# Altium schematic sheet 07-CAN&UART.SchDoc
size B
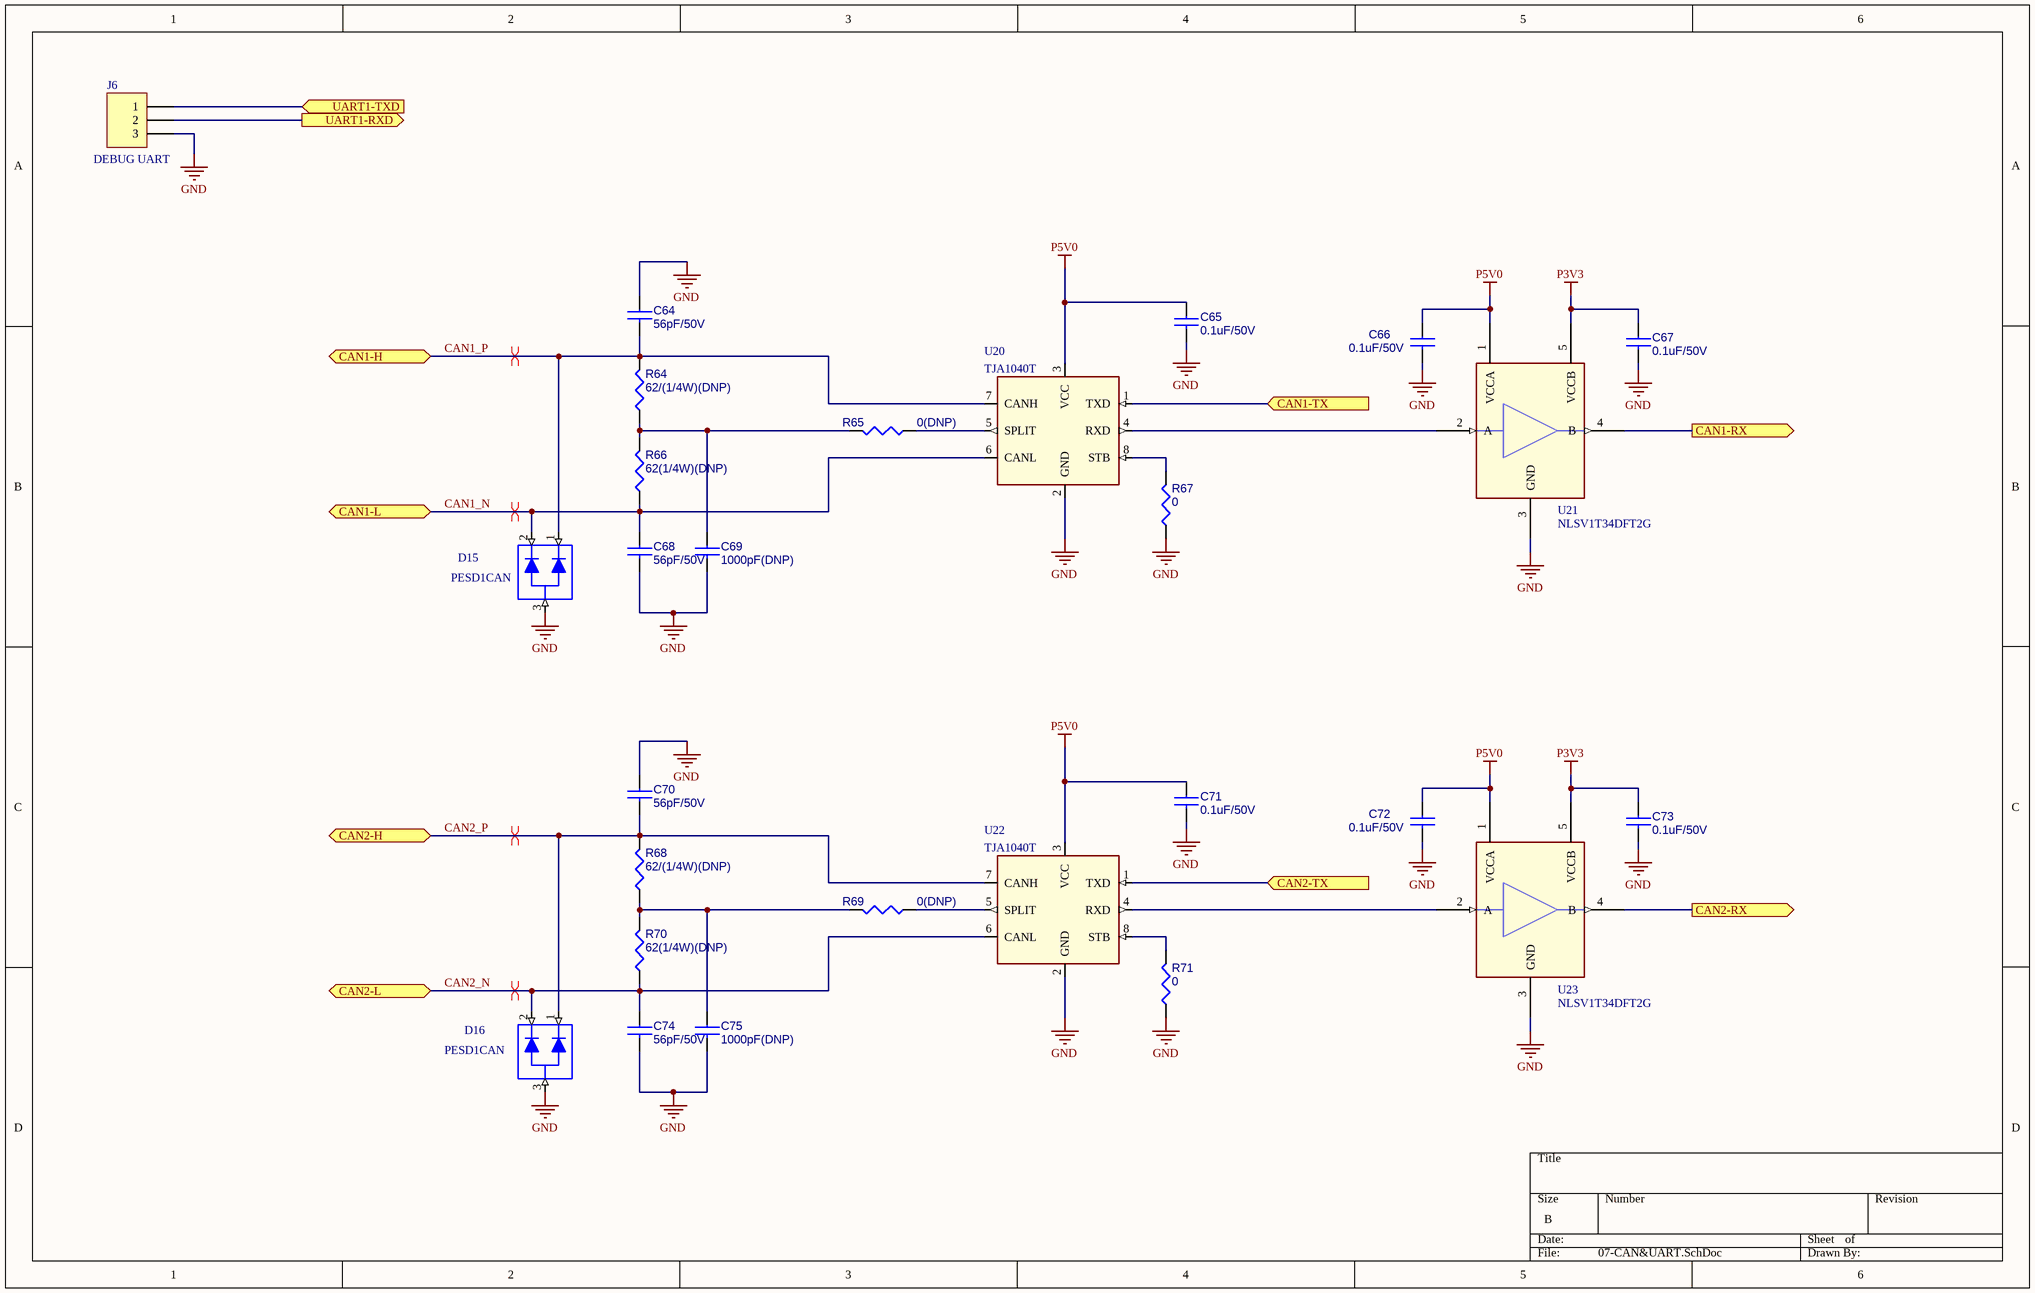
[diagram p0: 07-CAN&UART.SchDoc]

## Parts
C64  56pF/50V  [0402]
C65  0.1uF/50V  [0402]
C66  0.1uF/50V  [0402]
C67  0.1uF/50V  [0402]
C68  56pF/50V  [0402]
C69  1000pF(DNP)  [0402]
C70  56pF/50V  [0402]
C71  0.1uF/50V  [0402]
C72  0.1uF/50V  [0402]
C73  0.1uF/50V  [0402]
C74  56pF/50V  [0402]
C75  1000pF(DNP)  [0402]
D15  PESD1CAN  [PESD2CAN]
D16  PESD1CAN  [PESD2CAN]
J6  DEBUG UART  [HDR1X3]
R64  62/(1/4W)(DNP)  [1206]
R65  0(DNP)  [0402]
R66  62(1/4W)(DNP)  [1206]
R67  0  [0402]
R68  62/(1/4W)(DNP)  [1206]
R69  0(DNP)  [0402]
R70  62(1/4W)(DNP)  [1206]
R71  0  [0402]
U20  TJA1040T  [SO8]
U21  NLSV1T34DFT2G  [SC70]
U22  TJA1040T  [SO8]
U23  NLSV1T34DFT2G  [SC70]

## Ports
CAN1-H (bidir), CAN1-L (bidir), CAN1-RX (out), CAN1-TX (in), CAN2-H (bidir), CAN2-L (bidir), CAN2-RX (out), CAN2-TX (in), UART1-RXD (out), UART1-TXD (in)

## Nets
GND: C64.1 C65.2 C66.2 C67.2 C68.2 C69.2 C70.1 C71.2 C72.2 C73.2 C74.2 C75.2 D15.3 D16.3 J6.3 R67.2 R71.2 U20.2(GND) U21.3(GND) U22.2(GND) U23.3(GND)
P3V3: C67.1 C73.1 U21.5(VCCB) U23.5(VCCB)
P5V0: C65.1 C66.1 C71.1 C72.1 U20.3(VCC) U21.1(VCCA) U22.3(VCC) U23.1(VCCA)
CAN1-RX: U21.4(B) ; port CAN1-RX
CAN1-TX: U20.1(TXD) ; port CAN1-TX
CAN1_N: C68.1 D15.2 R66.2 U20.6(CANL) ; port CAN1-L
CAN1_P: C64.2 D15.1 R64.1 U20.7(CANH) ; port CAN1-H
CAN2-RX: U23.4(B) ; port CAN2-RX
CAN2-TX: U22.1(TXD) ; port CAN2-TX
CAN2_N: C74.1 D16.2 R70.2 U22.6(CANL) ; port CAN2-L
CAN2_P: C70.2 D16.1 R68.1 U22.7(CANH) ; port CAN2-H
UART1-RXD: J6.2 ; port UART1-RXD
UART1-TXD: J6.1 ; port UART1-TXD
NetC69_1: C69.1 R64.2 R65.1 R66.1
NetC75_1: C75.1 R68.2 R69.1 R70.1
NetR65_2: R65.2 U20.5(SPLIT)
NetR67_1: R67.1 U20.8(STB)
NetR69_2: R69.2 U22.5(SPLIT)
NetR71_1: R71.1 U22.8(STB)
NetU20_4: U20.4(RXD) U21.2(A)
NetU22_4: U22.4(RXD) U23.2(A)

## Layout directives
differential pair: CAN1_N, CAN1_P, CAN2_N, CAN2_P

## Library data of the parts
C64-C75 = P_CAP NP
D15 D16 = PESD2CAN: Part Number: SCA00000J00
J6 = Header 3: Header, 3-Pin; LatestRevisionDate: 17-Jul-2002; LatestRevisionNote: Re-released for DXP Platform.; Publisher: Altium Limited
R64-R71 = P_R
U20 U22 = TJA1040T_SO_8P: IC XCVR CAN HS 5V SO8; CAD_APPROVED: Yes; MFG_NAME01: NXP SEMICONDUCTORS; AGILE_PN: 312-79676; CLASS: IC; HEIGHT: 1.75 MM; ROHS: Yes; MFG_PN01: TJA1040T